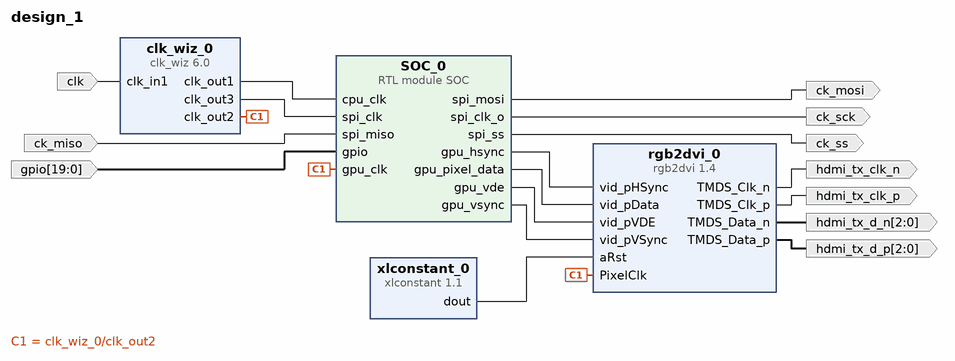
[diagram p0: block diagram of the top level]
# Vivado block design design_1, xc7z020clg400-1, Vivado 2021.2
create_bd_design design_1

create_bd_port -dir I -type clk clk
set_property -dict {CONFIG.FREQ_HZ 125000000 CONFIG.PHASE 0.0} [get_bd_ports clk]
create_bd_port -dir O -type clk hdmi_tx_clk_p
create_bd_port -dir O -type clk hdmi_tx_clk_n
create_bd_port -dir O -from 2 -to 0 hdmi_tx_d_p
create_bd_port -dir O -from 2 -to 0 hdmi_tx_d_n
create_bd_port -dir O ck_sck
create_bd_port -dir O ck_ss
create_bd_port -dir O ck_mosi
create_bd_port -dir I ck_miso
create_bd_port -dir I -from 19 -to 0 gpio

create_bd_cell -type ip -vlnv xilinx.com:ip:clk_wiz:6.0 clk_wiz_0
set_property -dict [list \
  CONFIG.CLKIN1_JITTER_PS 80.0 \
  CONFIG.CLKOUT1_DRIVES BUFG \
  CONFIG.CLKOUT1_JITTER 305.740 \
  CONFIG.CLKOUT1_PHASE_ERROR 265.359 \
  CONFIG.CLKOUT1_REQUESTED_OUT_FREQ 50 \
  CONFIG.CLKOUT2_DRIVES BUFG \
  CONFIG.CLKOUT2_JITTER 321.613 \
  CONFIG.CLKOUT2_PHASE_ERROR 265.359 \
  CONFIG.CLKOUT2_REQUESTED_OUT_FREQ 40 \
  CONFIG.CLKOUT2_USED true \
  CONFIG.CLKOUT3_DRIVES BUFG \
  CONFIG.CLKOUT3_JITTER 454.193 \
  CONFIG.CLKOUT3_PHASE_ERROR 265.359 \
  CONFIG.CLKOUT3_REQUESTED_OUT_FREQ 5 \
  CONFIG.CLKOUT3_USED true \
  CONFIG.CLKOUT4_DRIVES BUFG \
  CONFIG.CLKOUT5_DRIVES BUFG \
  CONFIG.CLKOUT6_DRIVES BUFG \
  CONFIG.CLKOUT7_DRIVES BUFG \
  CONFIG.CLK_IN1_BOARD_INTERFACE sys_clock \
  CONFIG.CLK_IN2_BOARD_INTERFACE Custom \
  CONFIG.FEEDBACK_SOURCE FDBK_AUTO \
  CONFIG.MMCM_BANDWIDTH OPTIMIZED \
  CONFIG.MMCM_CLKFBOUT_MULT_F 32.000 \
  CONFIG.MMCM_CLKIN1_PERIOD 8.000 \
  CONFIG.MMCM_CLKIN2_PERIOD 10.000 \
  CONFIG.MMCM_CLKOUT0_DIVIDE_F 16.000 \
  CONFIG.MMCM_CLKOUT1_DIVIDE 20 \
  CONFIG.MMCM_CLKOUT2_DIVIDE 128 \
  CONFIG.MMCM_COMPENSATION ZHOLD \
  CONFIG.MMCM_DIVCLK_DIVIDE 5 \
  CONFIG.NUM_OUT_CLKS 3 \
  CONFIG.PRIMITIVE MMCM \
  CONFIG.RESET_BOARD_INTERFACE Custom \
  CONFIG.USE_BOARD_FLOW true \
  CONFIG.USE_LOCKED false \
  CONFIG.USE_RESET false \
] [get_bd_cells clk_wiz_0]
create_bd_cell -type ip -vlnv digilentinc.com:ip:rgb2dvi:1.4 rgb2dvi_0
set_property -dict {CONFIG.kClkRange 3 CONFIG.kRstActiveHigh true} [get_bd_cells rgb2dvi_0]
create_bd_cell -type ip -vlnv xilinx.com:ip:xlconstant:1.1 xlconstant_0
set_property -dict {CONFIG.CONST_VAL 0} [get_bd_cells xlconstant_0]
create_bd_cell -type module -reference SOC SOC_0
set_property -dict {CONFIG.GPIO_PINS 20} [get_bd_cells SOC_0]

# ---- connections ----

connect_bd_net [get_bd_pins SOC_0/gpu_hsync] [get_bd_pins rgb2dvi_0/vid_pHSync]
connect_bd_net [get_bd_pins SOC_0/gpu_pixel_data] [get_bd_pins rgb2dvi_0/vid_pData]
connect_bd_net [get_bd_pins SOC_0/gpu_vde] [get_bd_pins rgb2dvi_0/vid_pVDE]
connect_bd_net [get_bd_pins SOC_0/gpu_vsync] [get_bd_pins rgb2dvi_0/vid_pVSync]
connect_bd_net [get_bd_pins SOC_0/spi_clk_o] [get_bd_ports ck_sck]
connect_bd_net [get_bd_pins SOC_0/spi_mosi] [get_bd_ports ck_mosi]
connect_bd_net [get_bd_pins SOC_0/spi_ss] [get_bd_ports ck_ss]
connect_bd_net [get_bd_ports ck_miso] [get_bd_pins SOC_0/spi_miso]
connect_bd_net [get_bd_ports clk] [get_bd_pins clk_wiz_0/clk_in1]
connect_bd_net [get_bd_pins clk_wiz_0/clk_out1] [get_bd_pins SOC_0/cpu_clk]
connect_bd_net [get_bd_pins clk_wiz_0/clk_out2] [get_bd_pins rgb2dvi_0/PixelClk] [get_bd_pins SOC_0/gpu_clk]
connect_bd_net [get_bd_pins clk_wiz_0/clk_out3] [get_bd_pins SOC_0/spi_clk]
connect_bd_net -net gpio_0_1 [get_bd_ports gpio] [get_bd_pins SOC_0/gpio]
connect_bd_net [get_bd_pins rgb2dvi_0/TMDS_Clk_n] [get_bd_ports hdmi_tx_clk_n]
connect_bd_net [get_bd_pins rgb2dvi_0/TMDS_Clk_p] [get_bd_ports hdmi_tx_clk_p]
connect_bd_net [get_bd_pins rgb2dvi_0/TMDS_Data_n] [get_bd_ports hdmi_tx_d_n]
connect_bd_net [get_bd_pins rgb2dvi_0/TMDS_Data_p] [get_bd_ports hdmi_tx_d_p]
connect_bd_net [get_bd_pins xlconstant_0/dout] [get_bd_pins rgb2dvi_0/aRst]

validate_bd_design
save_bd_design
